# EAGLE design USB Mux-v0.2 (EAGLE 6.5.0)
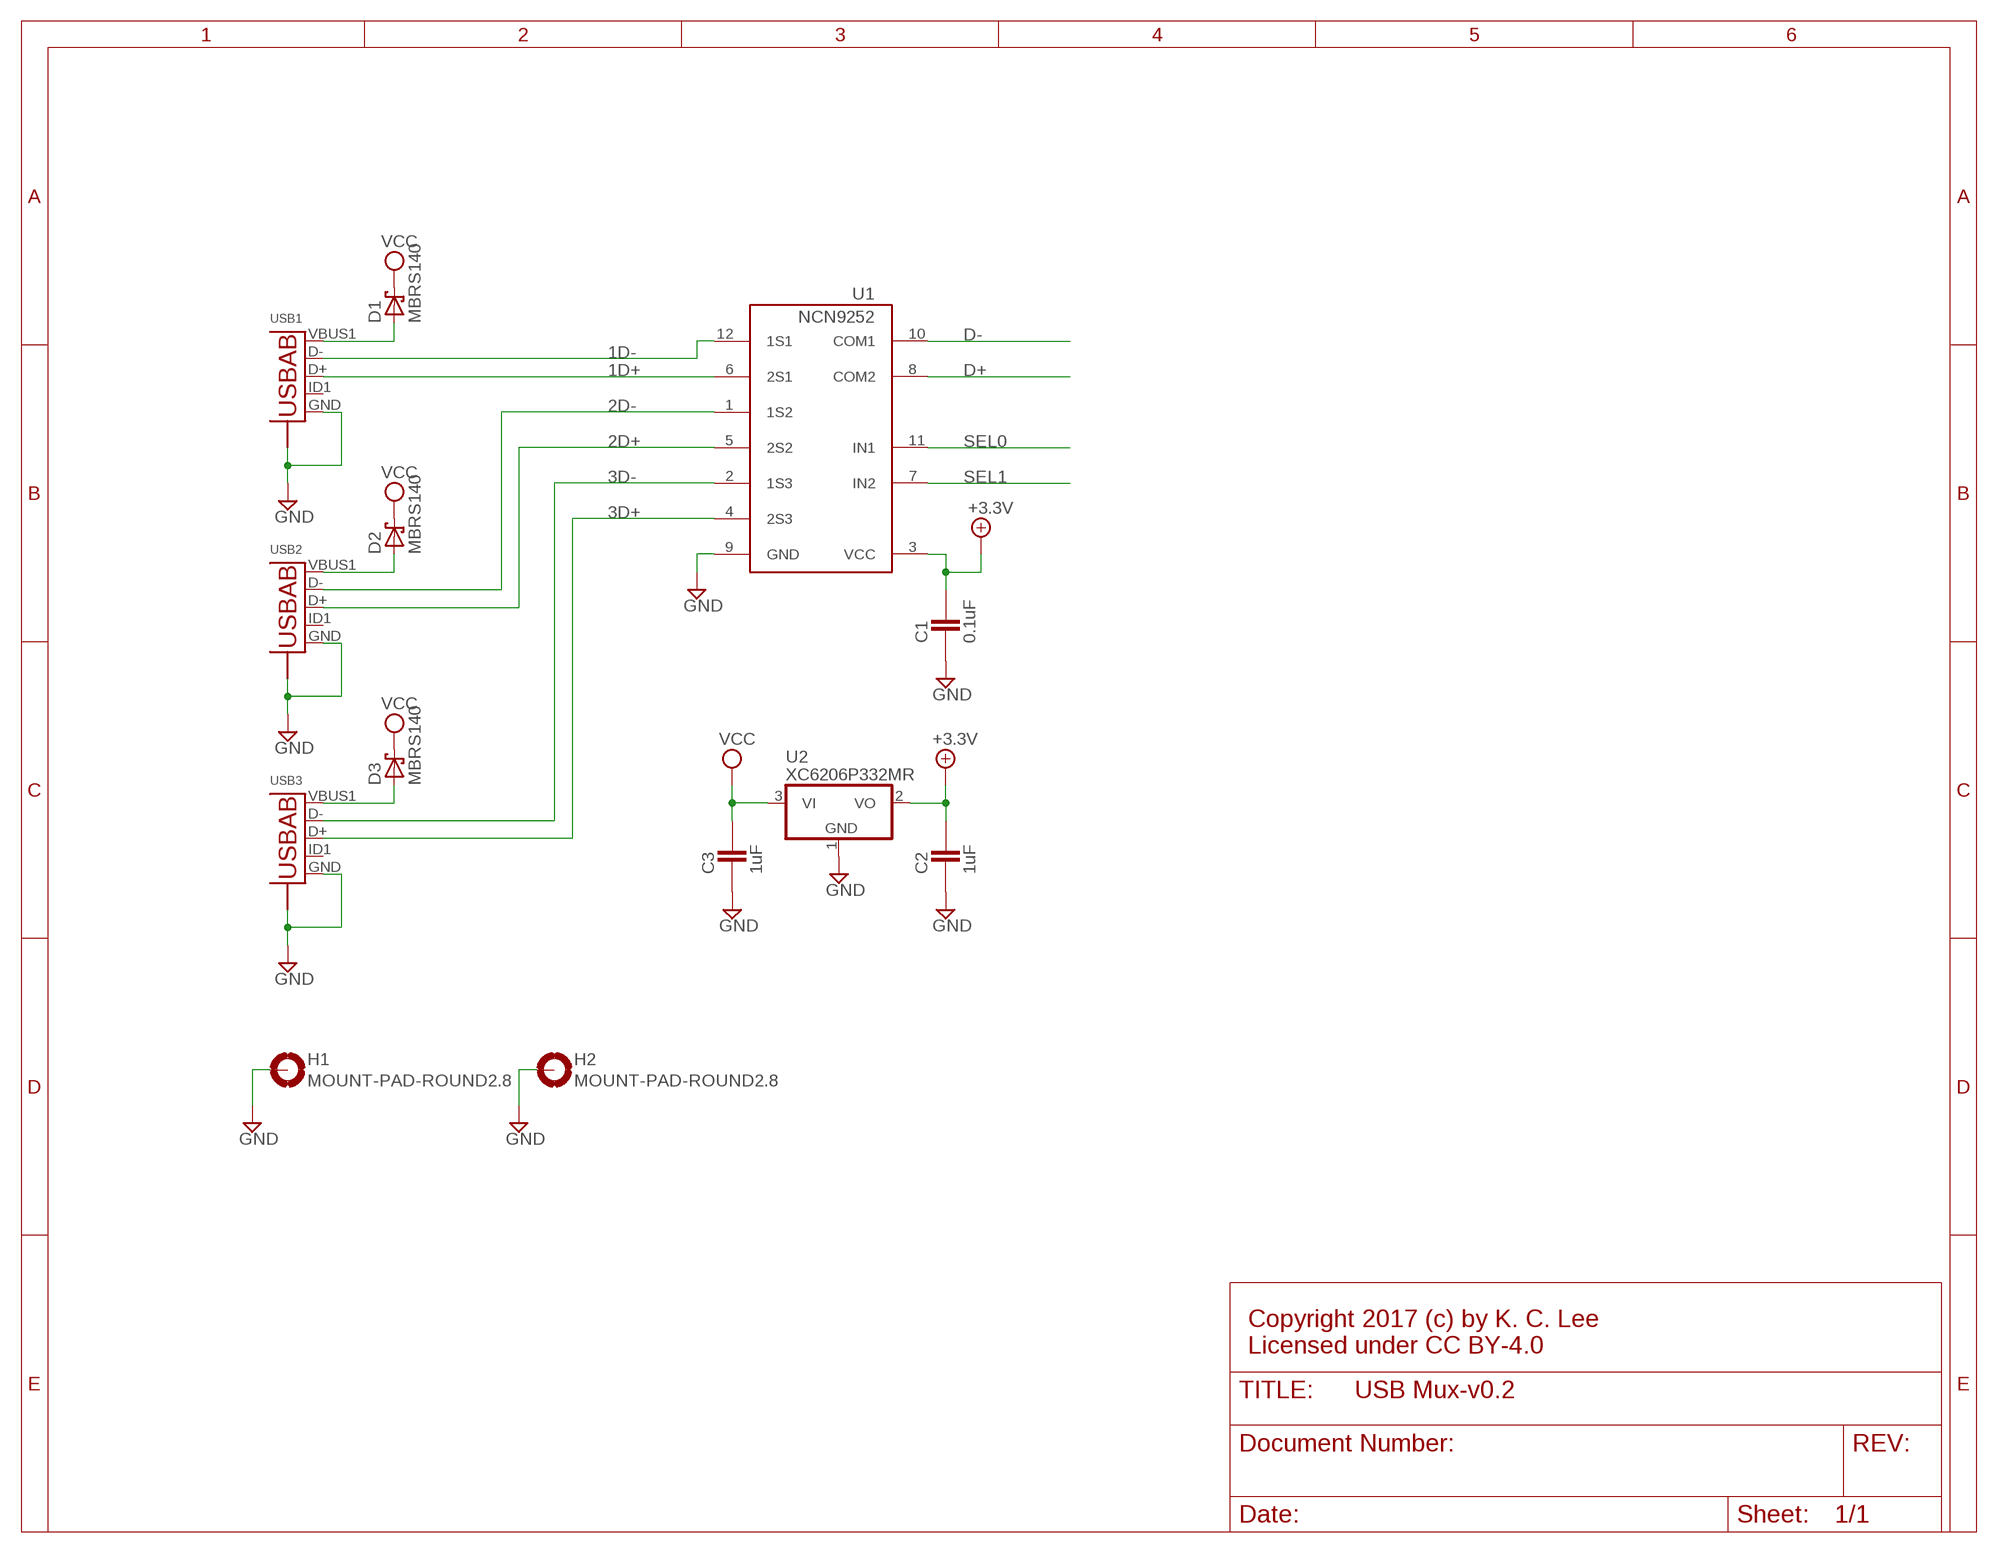
[diagram p0: schematic, sheet 1]

## Parts
C1  0.1uF  CAPACITOR_0603  [CAPC1608X92N]
C2  1uF  CAPACITOR_0603  [CAPC1608X92N]
C3  1uF  CAPACITOR_0603  [CAPC1608X92N]
D1  MBRS140  SCHOTTKY_SMB  [DIOM5436X265N]
D2  MBRS140  SCHOTTKY_SMB  [DIOM5436X265N]
D3  MBRS140  SCHOTTKY_SMB  [DIOM5436X265N]
H1  MOUNT-PAD-ROUND2.8  [2,8-PAD]
H2  MOUNT-PAD-ROUND2.8  [2,8-PAD]
U1  NCN9252  [UQN12]
U2  XC6206P332MR  MCP1700/TT  [SOT95P280X135-3N]
USB1  USB-ABBG-ORG  [USB-AB-MICRO-SMD_V03_SMT]
USB2  USB-ABBG-ORG  [USB-AB-MICRO-SMD_V03_SMT]
USB3  USB-ABBG-ORG  [USB-AB-MICRO-SMD_V03_SMT]

## Nets
1D+: U1.6(2S1) USB1.D+
1D-: U1.12(1S1) USB1.D-
2D+: U1.5(2S2) USB2.D+
2D-: U1.1(1S2) USB2.D-
3D+: U1.4(2S3) USB3.D+
3D-: U1.2(1S3) USB3.D-
+3.3V: C1.2 C2.2 U1.3(VCC) U2.2(VO)
D+: U1.8(COM2)
D-: U1.10(COM1)
GND: C1.1 C2.1 C3.1 H1.B2,8(MOUNT) H2.B2,8(MOUNT) U1.9(GND) U2.1(GND) USB1.GND USB1.S1(S) USB1.S2(S) USB1.S3(S) USB1.S4(S) USB2.GND USB2.S1(S) USB2.S2(S) USB2.S3(S) USB2.S4(S) USB3.GND USB3.S1(S) USB3.S2(S) USB3.S3(S) USB3.S4(S)
N$11: D3.A USB3.VBUS1(VBUS)
N$12: D2.A USB2.VBUS1(VBUS)
N$13: D1.A USB1.VBUS1(VBUS)
SEL0: U1.11(IN1)
SEL1: U1.7(IN2)
VCC: C3.2 D1.K D2.K D3.K U2.3(VI)
Unconnected: USB1.ID1(USBID) USB2.ID1(USBID) USB3.ID1(USBID)

## Notes on the sheet
- Copyright 2017 (c) by K. C. Lee
  Licensed under CC BY-4.0

## Library data of the parts
C1 = ipc-7351-capacitor:CAPACITOR_; PARTNO: 0U1 0603
C2 C3 = ipc-7351-capacitor:CAPACITOR_; PARTNO: 1UF 0603
D1-D3 = ipc-7351-diode:SCHOTTKY_; PARTNO: MBRS140
H1 H2 = holes:MOUNT-PAD-ROUND: MOUNTING PAD, round; PARTNO: *
U1 = Misc Analog:NCN9252; PARTNO: NCN9252
U2 = Misc Power:MCP1700; PARTNO: XC6206P332MR
USB1-USB3 = Misc Conn:USB-AB: This is a USB AB connector that is compatible with USB OTG. i.e. this connector can serve as a host or device; PARTNO: SMT MICRO USB CONNECTOR

## Board
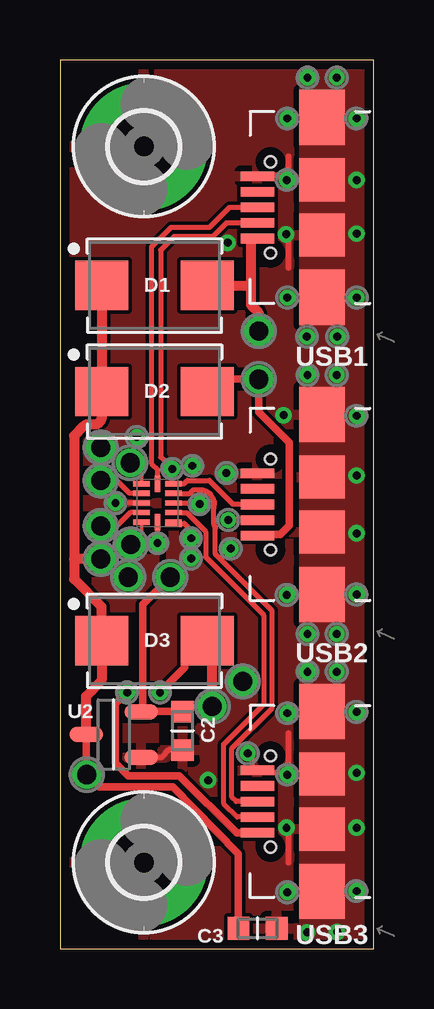
[diagram p1: board, top side]
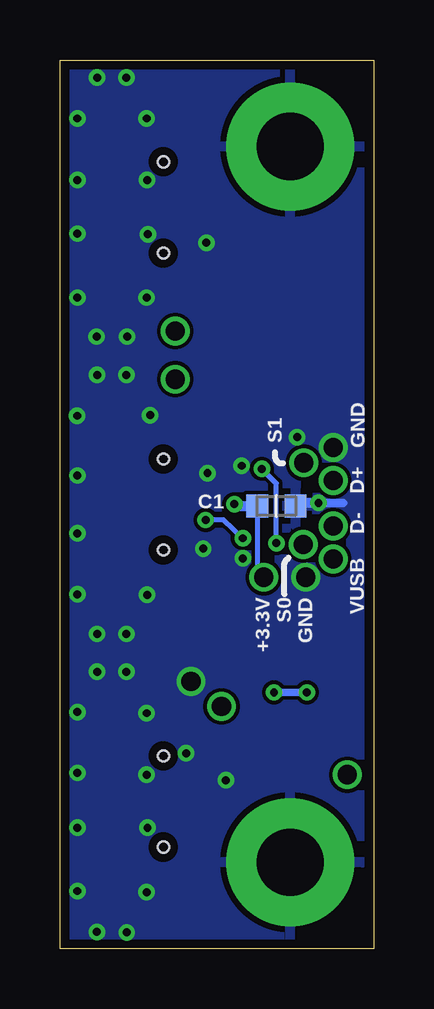
[diagram p2: board, bottom side, seen from below]

Size 13.08 x 37.06 mm. Coordinates in mm from the lower left corner, seen from the top.
Outline: 0,0 13.08,0 13.08,37.06 0,37.06 0,0
Copper layers (1*16): Top 0.0356mm / dielectric 1.5011mm / Bottom 0.0356mm
Design rules "oshpark-2layer-tented-vias": minimum track width 6mil, minimum drill 13mil, track to track 6mil, track to pad 6mil, pad to pad 6mil, via to via 6mil, smd to smd 6mil, copper to edge 15mil, drill to drill 6mil, minimum pad ring 7mil, minimum via ring 7mil, stop-mask expansion 4mil, vias tented up to drill 13mil, thermal gap 10mil
tRestrict: 1 lines

### Footprints (pad centres in the part's own frame; a part is rotated, then mirrored left to right if it is on the bottom)
CAPC1608X92N = smd 0.9 x 0.95: 1 -0.8,0; 2 0.8,0
DIOM5436X265N = smd 2.2 x 2.05: A 2.2,0; K -2.2,0
2,8-PAD = drill 2.8 pad 5.334: B2,8 0,0
UQN12 = smd 0.69 x 0.32: 1 -0.665,0.85 | smd 0.69 x 0.22: 2 -0.665,0.4; 3 -0.665,0; 4 -0.665,-0.4; 5 -0.665,-0.8; 7 0.665,-0.8; 8 0.665,-0.4; 9 0.665,0; 10 0.665,0.4; 11 0.665,0.8 | smd 0.22 x 0.69: 6 0,-0.805; 12 0,0.805
SOT95P280X135-3N = smd 1.4 x 0.65: 1 -1.15,0.95; 2 -1.15,-0.95; 3 1.15,0
USB-AB-MICRO-SMD_V03_SMT = smd 1.4 x 0.4: D+ 2.7,0; D- 2.7,0.65; GND 2.7,-1.3; ID1 2.7,-0.65; VBUS1 2.7,1.3 | smd 1.9 x 2.3: S1 0,3.75; S4 0,-3.75 | smd 1.9 x 1.8: S2 0,1.15; S3 0,-1.15 | hole 0.45: 2.15,1.9; 2.15,-1.9

### Placement (x,y rotation side)
C1  4.06,18.47 180 bottom
C2  5.11,9.09 90 top
C3  8.23,0.86 180 top
D1  3.94,27.66 0 top
D2  3.94,23.24 0 top
D3  3.94,12.85 0 top
H1  3.49,33.45 0 top
H2  3.49,3.61 0 top
U1  4.06,18.59 180 top
U2  2.24,8.94 180 top
USB1  10.92,30.91 180 top
USB2  10.92,18.53 180 top
USB3  10.92,6.15 180 top

### Tracks (layer width: path | path; a pad name or v marks a point on that pad's centre or on a via)
1D+
  Top 0.203: U1.6 4.06,19.99 3.81,20.24 3.81,29.26 4.62,30.07 6.22,30.07 7.06,30.91 USB1.D+
1D-  (via drill 0.33)
  Top 0.203: v4.06,16.92 U1.12 | v4.67,20.01 4.19,20.5 4.19,29.13 4.76,29.7 6.36,29.7 6.92,30.26 USB1.D-
  Bottom 0.203: v4.06,16.92 4.06,19.41 v4.67,20.01
2D+
  Top 0.203: U1.5 5.17,19.39 5.31,19.53 6.22,19.53 7.23,18.53 USB2.D+
2D-  (via drill 0.33)
  Top 0.203: U1.1 5.17,17.74 5.46,17.45 v5.46,17.12 | v7.01,17.88 7.16,17.88 7.39,17.88 USB2.D-
  Bottom 0.203: v5.46,17.12 6.27,17.88 v7.01,17.88
3D+
  Top 0.203: U1.4 5.4,18.99 5.56,19.15 5.82,19.15 arc-90 6.43,18.52 6.43,18.43 arc-45 6.4,18.36 6.4,17.81 arc45 6.47,17.58 6.48,17.53 6.48,16.46 8.84,14.1 8.84,10.03 7.16,8.36 7.16,6.32 7.34,6.15 USB3.D+
3D-
  Top 0.203: U1.2 5.28,18.19 6.07,17.4 6.07,16.33 8.48,13.92 8.48,10.19 6.81,8.51 6.81,6.07 7.38,5.5 USB3.D-
+3.3V  (via drill 0.33, 0.8)
  Top 0.203: U1.3 5.77,18.59 v5.82,18.54
  Top 0.305: v4.6,15.49 3.45,14.35 3.45,9.9 U2.2 C2.2
  Bottom 0.203: C1.2 4.86,15.76 v4.6,15.49
  Bottom 0.406: v5.82,18.54 5.74,18.47 C1.2
D+  (via drill 0.8)
  Top 0.203: v1.7,19.53 2.36,19.53 2.9,18.99 U1.8
D-  (via drill 0.8)
  Top 0.203: U1.10 2.93,18.19 2.36,17.63 v1.7,17.63
GND  (via drill 0.33, 0.8)
  Top 0.203: U1.9 v2.31,18.59 | v7.82,8.15 8.01,7.99 8,7.44 USB3.GND 8.66,7.45 8.74,7.37 9.37,7.37 v9.47,7.26
  Top 0.254: C2.1 4.53,8.29 4.23,7.99 U2.1 | 9.53,3.61 9.53,4.88 | 9.53,7.26 9.53,8.99 | 9.53,28.4 9.53,29.67 | 9.53,33.05 9.53,32.44 9.45,32.38 9.45,32.21
  Top 0.305: USB1.GND 9.45,32.21 v9.45,32.05
  Bottom 0.356: v2.31,18.59 1.27,18.59
  Bottom 0.406: v2.31,18.59 3.26,18.59 C1.1
  other vias: 10.31,13.13 10.29,25.53 9.47,34.62 12.36,34.62 9.47,27.15 12.36,27.15 9.32,22.25 12.37,22.23 9.47,9.83 12.36,9.88 9.45,14.76 12.36,14.78 12.36,2.41 9.47,2.36 7.11,16.69 6.93,19.84 10.31,36.32 11.53,23.93 11.53,11.56 6.99,29.44 6.17,7.04 2.84,15.49 5.51,20.14 5.46,16.28 1.7,20.9 3.2,21.34 12.36,7.34 12.36,5.05 9.44,5.05 12.36,17.32 12.36,19.74 12.36,29.82 9.42,29.79 12.36,32.05 10.3,0.69 11.53,36.32 11.56,25.53 10.31,23.93 11.53,13.13 10.31,11.56 11.54,0.71 7.62,11.15
  pour Bottom: 13.08,37.26 13.08,-0.2 0,-0.2 0,37.26
  pour Top: 0,37.26 0,-0.2 13.08,-0.2 13.08,37.26
  pour Top (no thermals): 10.16,36.5 10.16,0.43 12.57,0.43 12.57,36.5
N$11  (via drill 0.33, 0.8)
  Top 0.305: USB3.VBUS1 7.37,4.85 4.98,7.21 2.85,7.21 2.31,7.75 2.31,10.21 v2.79,10.69 | D3.A 5.76,12.53 5.21,12.06 5.21,11.73 v4.17,10.69
  Top 0.406: v6.35,10.11 6.35,11.95 5.76,12.53
  Bottom 0.305: v4.17,10.69 v2.79,10.69
N$12  (via drill 0.8)
  Top 0.305: USB2.VBUS1 8.16,17.23 8.2,17.27 9.17,17.27 9.55,17.65 9.55,21.11 8.28,22.38 v8.28,23.75 6.99,23.75 6.35,23.24 D2.A
N$13  (via drill 0.8)
  Top 0.406: USB1.VBUS1 8.01,29.6 7.95,29.51 7.95,27.69 | 7.95,27.69 7.95,26.85 8.28,26.52 v8.28,25.76 | D1.A 7.92,27.66 7.95,27.69
SEL0  (via drill 0.8)
  Top 0.152: U1.11 3.4,17.32 v2.95,16.87
SEL1  (via drill 0.8)
  Top 0.152: v2.92,20.27 3.4,19.79 U1.7
VCC  (via drill 0.8)
  Top 0.305: C3.2 7.43,3.97 4.7,6.76 1.63,6.76 v1.12,7.26 1.08,7.3 U2.3
  Top 0.406: D1.K D2.K 1.74,22.16 arc-45 1.66,21.98 1.55,21.87 1.17,21.87 arc45 0.99,21.79 0.58,21.39 0.58,16.26 | U2.3 1.08,10.53 1.74,11.19 D3.K 1.74,14.26 0.58,15.42 0.58,16.26 | v1.7,16.26 0.58,16.26

### Text on the board
bNames: S1 | GND | D+ | D- | VUSB | GND | S0 | +3.3V